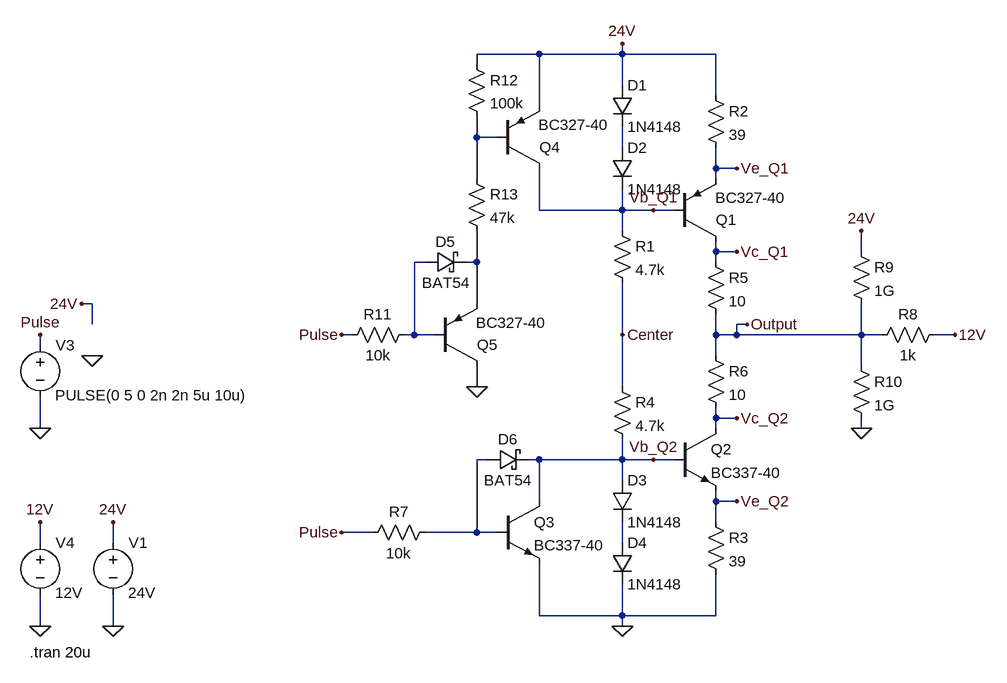
[diagram p0: schematic PushPullDigital.asc]
PushPullDigital.asc, the LTspice schematic file:
Version 4
SHEET 1 3164 932
WIRE 752 -1824 656 -1824
WIRE 880 -1824 880 -1840
WIRE 880 -1824 752 -1824
WIRE 1024 -1824 880 -1824
WIRE 656 -1808 656 -1824
WIRE 880 -1776 880 -1824
WIRE 1024 -1760 1024 -1824
WIRE 752 -1744 752 -1824
WIRE 656 -1696 656 -1728
WIRE 688 -1696 656 -1696
WIRE 880 -1680 880 -1712
WIRE 1024 -1648 1024 -1680
WIRE 1056 -1648 1024 -1648
WIRE 656 -1632 656 -1696
WIRE 1024 -1632 1024 -1648
WIRE 752 -1584 752 -1648
WIRE 880 -1584 880 -1616
WIRE 880 -1584 752 -1584
WIRE 928 -1584 880 -1584
WIRE 960 -1584 928 -1584
WIRE 880 -1552 880 -1584
WIRE 1024 -1520 1024 -1536
WIRE 1056 -1520 1024 -1520
WIRE 1248 -1520 1248 -1552
WIRE 576 -1504 560 -1504
WIRE 656 -1504 656 -1552
WIRE 656 -1504 640 -1504
WIRE 1024 -1504 1024 -1520
WIRE 64 -1440 48 -1440
WIRE 656 -1440 656 -1504
WIRE 64 -1408 64 -1440
WIRE 1072 -1408 1056 -1408
WIRE 464 -1392 448 -1392
WIRE 560 -1392 560 -1504
WIRE 560 -1392 544 -1392
WIRE 592 -1392 560 -1392
WIRE 880 -1392 880 -1472
WIRE 1024 -1392 1024 -1424
WIRE 1056 -1392 1056 -1408
WIRE 1056 -1392 1024 -1392
WIRE 1248 -1392 1248 -1440
WIRE 1248 -1392 1056 -1392
WIRE 1280 -1392 1248 -1392
WIRE 1392 -1392 1360 -1392
WIRE -16 -1376 -16 -1392
WIRE 1024 -1360 1024 -1392
WIRE 1248 -1344 1248 -1392
WIRE 656 -1312 656 -1344
WIRE 880 -1312 880 -1392
WIRE 1024 -1264 1024 -1280
WIRE 1056 -1264 1024 -1264
WIRE -16 -1248 -16 -1296
WIRE 1024 -1248 1024 -1264
WIRE 1248 -1248 1248 -1264
WIRE 672 -1200 656 -1200
WIRE 752 -1200 736 -1200
WIRE 880 -1200 880 -1232
WIRE 880 -1200 752 -1200
WIRE 928 -1200 880 -1200
WIRE 960 -1200 928 -1200
WIRE 880 -1168 880 -1200
WIRE 752 -1136 752 -1200
WIRE 1024 -1136 1024 -1152
WIRE 1056 -1136 1024 -1136
WIRE 1024 -1104 1024 -1136
WIRE 496 -1088 448 -1088
WIRE 656 -1088 656 -1200
WIRE 656 -1088 576 -1088
WIRE 688 -1088 656 -1088
WIRE -16 -1072 -16 -1104
WIRE 96 -1072 96 -1104
WIRE 880 -1072 880 -1104
WIRE 752 -960 752 -1040
WIRE 880 -960 880 -1008
WIRE 880 -960 752 -960
WIRE 1024 -960 1024 -1024
WIRE 1024 -960 880 -960
WIRE -16 -944 -16 -992
WIRE 96 -944 96 -992
WIRE 880 -944 880 -960
FLAG 96 -944 0
FLAG 96 -1104 24V
FLAG 880 -944 0
FLAG 1072 -1408 Output
FLAG 928 -1200 Vb_Q2
FLAG 928 -1584 Vb_Q1
FLAG 1056 -1264 Vc_Q2
FLAG 1056 -1520 Vc_Q1
FLAG 880 -1392 Center
FLAG 64 -1360 0
FLAG 48 -1440 24V
FLAG -16 -1248 0
FLAG 880 -1840 24V
FLAG -16 -944 0
FLAG -16 -1104 12V
FLAG 1392 -1392 12V
FLAG 1056 -1648 Ve_Q1
FLAG 1056 -1136 Ve_Q2
FLAG 1248 -1248 0
FLAG 1248 -1552 24V
FLAG -16 -1392 Pulse
FLAG 448 -1088 Pulse
FLAG 656 -1312 0
FLAG 448 -1392 Pulse
SYMBOL res 864 -1568 R0
SYMATTR InstName R1
SYMATTR Value 4.7k
SYMBOL diode 864 -1776 R0
SYMATTR InstName D1
SYMATTR Value 1N4148
SYMBOL voltage 96 -1088 R0
WINDOW 3 23 93 Left 2
WINDOW 123 0 0 Left 2
WINDOW 39 -29 126 VLeft 2
SYMATTR Value 24V
SYMATTR InstName V1
SYMBOL npn 960 -1248 R0
SYMATTR InstName Q2
SYMATTR Value BC337-40
SYMBOL pnp 960 -1536 M180
WINDOW 0 64 33 Left 2
WINDOW 3 63 67 Left 2
SYMATTR InstName Q1
SYMATTR Value BC327-40
SYMBOL res 1008 -1776 R0
SYMATTR InstName R2
SYMATTR Value 39
SYMBOL res 1008 -1120 R0
SYMATTR InstName R3
SYMATTR Value 39
SYMBOL diode 864 -1680 R0
SYMATTR InstName D2
SYMATTR Value 1N4148
SYMBOL diode 864 -1168 R0
SYMATTR InstName D3
SYMATTR Value 1N4148
SYMBOL diode 864 -1072 R0
SYMATTR InstName D4
SYMATTR Value 1N4148
SYMBOL res 864 -1328 R0
SYMATTR InstName R4
SYMATTR Value 4.7k
SYMBOL res 1008 -1520 R0
SYMATTR InstName R5
SYMATTR Value 10
SYMBOL res 1008 -1376 R0
SYMATTR InstName R6
SYMATTR Value 10
SYMBOL res 592 -1104 R90
WINDOW 0 0 56 VBottom 2
WINDOW 3 32 56 VTop 2
SYMATTR InstName R7
SYMATTR Value 10k
SYMBOL voltage -16 -1392 R0
WINDOW 3 23 93 Left 2
WINDOW 123 0 0 Left 2
WINDOW 39 -29 126 VLeft 2
SYMATTR Value PULSE(0 5 0 2n 2n 5u 10u)
SYMATTR InstName V3
SYMBOL res 1376 -1408 R90
WINDOW 0 0 56 VBottom 2
WINDOW 3 32 56 VTop 2
SYMATTR InstName R8
SYMATTR Value 1k
SYMBOL voltage -16 -1088 R0
WINDOW 3 23 93 Left 2
WINDOW 123 0 0 Left 2
WINDOW 39 -29 126 VLeft 2
SYMATTR Value 12V
SYMATTR InstName V4
SYMBOL res 1232 -1536 R0
SYMATTR InstName R9
SYMATTR Value 1G
SYMBOL res 1232 -1360 R0
SYMATTR InstName R10
SYMATTR Value 1G
SYMBOL npn 688 -1136 R0
SYMATTR InstName Q3
SYMATTR Value BC337-40
SYMBOL schottky 672 -1184 R270
WINDOW 0 32 32 VTop 2
WINDOW 3 0 32 VBottom 2
SYMATTR InstName D6
SYMATTR Value BAT54
SYMATTR Description Diode
SYMATTR Type diode
SYMBOL pnp 688 -1648 M180
WINDOW 0 64 33 Left 2
WINDOW 3 63 67 Left 2
SYMATTR InstName Q4
SYMATTR Value BC327-40
SYMBOL pnp 592 -1344 M180
WINDOW 0 64 33 Left 2
WINDOW 3 63 67 Left 2
SYMATTR InstName Q5
SYMATTR Value BC327-40
SYMBOL res 560 -1408 R90
WINDOW 0 0 56 VBottom 2
WINDOW 3 32 56 VTop 2
SYMATTR InstName R11
SYMATTR Value 10k
SYMBOL res 640 -1648 R0
SYMATTR InstName R13
SYMATTR Value 47k
SYMBOL schottky 576 -1488 R270
WINDOW 0 32 32 VTop 2
WINDOW 3 0 32 VBottom 2
SYMATTR InstName D5
SYMATTR Value BAT54
SYMATTR Description Diode
SYMATTR Type diode
SYMBOL res 640 -1824 R0
SYMATTR InstName R12
SYMATTR Value 100k
TEXT -32 -904 Left 2 !.tran 20u

The netlist it stands for:
* PushPullDigital.asc
R1 Vb_Q1 Center 4.7k
D1 24V N002 1N4148
V1 24V 0 24V
Q2 Vc_Q2 Vb_Q2 Ve_Q2 0 BC337-40
Q1 Vc_Q1 Vb_Q1 Ve_Q1 0 BC327-40
R2 24V Ve_Q1 39
R3 Ve_Q2 0 39
D2 N002 Vb_Q1 1N4148
D3 Vb_Q2 N006 1N4148
D4 N006 0 1N4148
R4 Center Vb_Q2 4.7k
R5 Vc_Q1 Output 10
R6 Output Vc_Q2 10
R7 N005 Pulse 10k
V3 Pulse 0 PULSE(0 5 0 2n 2n 5u 10u)
R8 12V Output 1k
V4 12V 0 12V
R9 24V Output 1G
R10 Output 0 1G
Q3 Vb_Q2 N005 0 0 BC337-40
D6 N005 Vb_Q2 BAT54
Q4 Vb_Q1 N001 24V 0 BC327-40
Q5 0 N003 N004 0 BC327-40
R11 N003 Pulse 10k
R13 N001 N004 47k
D5 N003 N004 BAT54
R12 24V N001 100k
.model D D
.lib standard.dio
.model NPN NPN
.model PNP PNP
.lib standard.bjt
.tran 20u
.backanno
.end